# EAGLE design BMS (EAGLE 9.1.0)
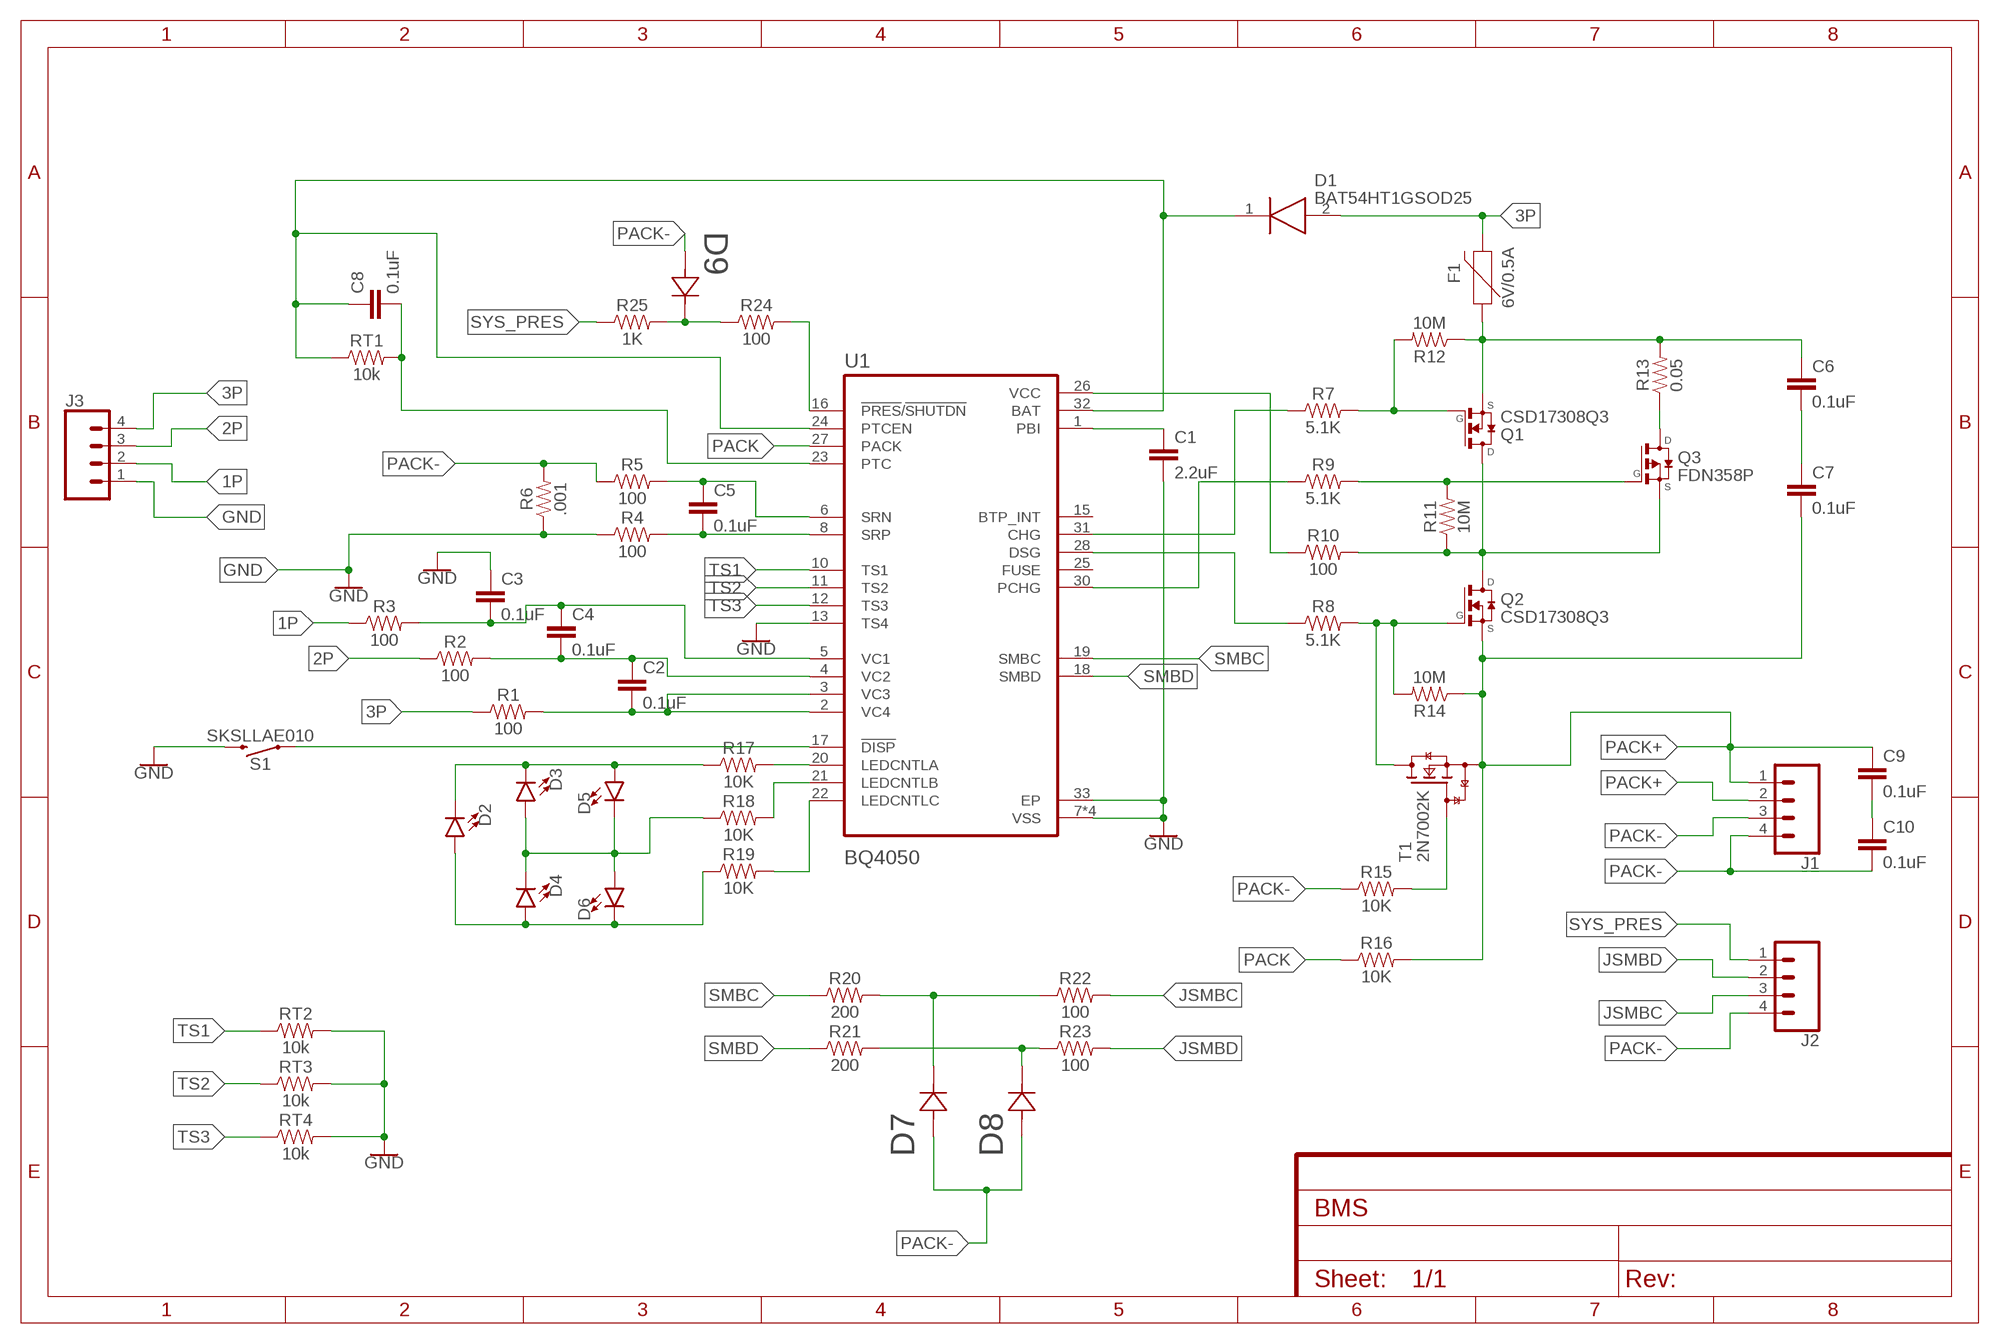
[diagram p0: schematic, sheet 1]

## Parts
C1  2.2uF  2.2UF-CERCAP-07888  [0402-CAP]
C2  0.1uF  0.1UF-0402-16V-10%  [0402]
C3  0.1uF  0.1UF-0402-16V-10%  [0402]
C4  0.1uF  0.1UF-0402-16V-10%  [0402]
C5  0.1uF  0.1UF-0402-16V-10%  [0402]
C6  0.1uF  0.1UF-0402-16V-10%  [0402]
C7  0.1uF  0.1UF-0402-16V-10%  [0402]
C8  0.1uF  0.1UF-0402-16V-10%  [0402]
C9  0.1uF  0.1UF-0402-16V-10%  [0402]
C10  0.1uF  0.1UF-0402-16V-10%  [0402]
D1  BAT54HT1GSOD25  [SOD2512X100]
D2  LTW-S272TLA-1175391  [LTW-S272TLA-1175391]
D3  LTW-S272TLA-1175391  [LTW-S272TLA-1175391]
D4  LTW-S272TLA-1175391  [LTW-S272TLA-1175391]
D5  LTW-S272TLA-1175391  [LTW-S272TLA-1175391]
D6  LTW-S272TLA-1175391  [LTW-S272TLA-1175391]
D7  D7  MM3Z5V6ST1G  [SODFL2513X100]
D8  D8  MM3Z5V6ST1G  [SODFL2513X100]
D9  D9  MM3Z5V6ST1G  [SODFL2513X100]
F1  6V/0.5A  PPTC_HALF-AMP  [1206]
J1  CONN_041.3HOLE  [1X04_1.3HOLE]
J2  CONN_041.3HOLE  [1X04_1.3HOLE]
J3  CONN_041X04_NO_SILK  [1X04_NO_SILK]
Q1  CSD17308Q3  [SON8-Q3]
Q2  CSD17308Q3  [SON8-Q3]
Q3  FDN358P  [SSOT-3]
R1  100  100KOHM-0402-1/16W-1%  [0402]
R2  100  100KOHM-0402-1/16W-1%  [0402]
R3  100  100KOHM-0402-1/16W-1%  [0402]
R4  100  100KOHM-0402-1/16W-1%  [0402]
R5  100  100KOHM-0402-1/16W-1%  [0402]
R6  .001  RNC18AQ00R001FE  [RESC3015X65]
R7  5.1K  100KOHM-0402-1/16W-1%  [0402]
R8  5.1K  100KOHM-0402-1/16W-1%  [0402]
R9  5.1K  100KOHM-0402-1/16W-1%  [0402]
R10  100  100KOHM-0402-1/16W-1%  [0402]
R11  10M  100KOHM-0402-1/16W-1%  [0402]
R12  10M  100KOHM-0402-1/16W-1%  [0402]
R13  0.05  0.05OHM-2512-3W-1%  [2512]
R14  10M  100KOHM-0402-1/16W-1%  [0402]
R15  10K  100KOHM-0402-1/16W-1%  [0402]
R16  10K  100KOHM-0402-1/16W-1%  [0402]
R17  10K  100KOHM-0402-1/16W-1%  [0402]
R18  10K  100KOHM-0402-1/16W-1%  [0402]
R19  10K  100KOHM-0402-1/16W-1%  [0402]
R20  200  100KOHM-0402-1/16W-1%  [0402]
R21  200  100KOHM-0402-1/16W-1%  [0402]
R22  100  100KOHM-0402-1/16W-1%  [0402]
R23  100  100KOHM-0402-1/16W-1%  [0402]
R24  100  100KOHM-0402-1/16W-1%  [0402]
R25  1K  100KOHM-0402-1/16W-1%  [0402]
RT1  10k  TFPT1206L1002FM1206  [1206]
RT2  10k  NTCLE100E3  [NTC-RESISTOR]
RT3  10k  NTCLE100E3  [NTC-RESISTOR]
RT4  10k  NTCLE100E3  [NTC-RESISTOR]
S1  SKSLLAE010  [SWITCH]
T1  2N7002K  [SOT23]
U1  BQ4050  BQ4050RSMTBQ4050  [QFN40P400X400X100-33T140]

## Nets
1P: J3.2 R3.1
2P: J3.3 R2.1
3P: D1.2(A) F1.2 J3.4 R1.1
GND: C1.2 C3.1 J3.1 R4.1 R6.1 RT2.2 RT3.2 RT4.2 S1.P$2 U1.7(VSS) U1.9(VSS) U1.13(TS4) U1.14(VSS) U1.29(VSS) U1.33(EP)
JSMBC: J2.3 R22.2
JSMBD: J2.2 R23.2
N$1: C1.1 U1.1(PBI)
N$2: C5.2 R4.2 U1.8(SRP)
N$3: S1.P$1 U1.17(!DISP)
N$4: C3.2 C4.1 R3.2 U1.5(VC1)
N$5: C2.2 R1.2 U1.2(VC4) U1.3(VC3)
N$6: C5.1 R5.2 U1.6(SRN)
N$7: C2.1 C4.2 R2.2 U1.4(VC2)
N$8: Q1.4(G) R7.2 R12.2
N$9: R7.1 U1.31(CHG)
N$10: R8.1 U1.28(DSG)
N$11: Q2.4(G) R8.2 R14.2 T1.3(D)
N$12: Q1.5(D) Q1.6(D) Q1.7(D) Q1.8(D) Q2.5(D) Q2.6(D) Q2.7(D) Q2.8(D) Q3.2(S) R10.2 R11.1
N$13: R10.1 U1.26(VCC)
N$14: R9.1 U1.30(PCHG)
N$15: Q3.1(G) R9.2 R11.2
N$16: Q3.3(D) R13.P$1
N$18: R15.2 T1.1(G)
N$19: C6.2 C7.1
N$20: R17.2 U1.20(LEDCNTLA)
N$21: D2.P$1(C) D3.P$1(C) D5.P$2(A) R17.1
N$22: D2.P$2(A) D4.P$2(A) D6.P$1(C) R19.1
N$23: R19.2 U1.22(LEDCNTLC)
N$24: R18.2 U1.21(LEDCNTLB)
N$25: D3.P$2(A) D4.P$1(C) D5.P$1(C) D6.P$2(A) R18.1
N$26: D7.1 R20.2 R22.1
N$27: D8.1 R21.2 R23.1
N$28: C9.2 C10.1
N$29: C6.1 F1.1 Q1.1(S) Q1.2(S) Q1.3(S) R12.1 R13.P$2
N$30: R24.2 U1.16(!PRES!/!SHUTDN)
N$31: D9.1 R24.1 R25.2
N$33: C8.2 RT1.2 U1.23(PTC)
N$34: C8.1 D1.1(K) RT1.1 U1.24(PTCEN) U1.32(BAT)
PACK: R16.1 U1.27(PACK)
PACK+: C7.2 C9.1 J1.1 J1.2 Q2.1(S) Q2.2(S) Q2.3(S) R14.1 R16.2 T1.2(S)
PACK-: C10.2 D7.2 D8.2 D9.2 J1.3 J1.4 J2.4 R5.1 R6.2 R15.1
SMBC: R20.1 U1.19(SMBC)
SMBD: R21.1 U1.18(SMBD)
SYS_PRES: J2.1 R25.1
TS1: RT2.1 U1.10(TS1)
TS2: RT3.1 U1.11(TS2)
TS3: RT4.1 U1.12(TS3)
Unconnected: U1.15(BTP_INT) U1.25(FUSE)

## Library data of the parts
C1 = SparkFun-Retired:2.2UF-CER: 2.2uF Ceramic SMT CAP-07888- 10V, 20% (0603) CAP-10009- 50V, 10% (1206); PROD_ID: CAP-07888
C2-C10 = SparkFun-Capacitors:0.1UF: 0.1µF ceramic capacitors A capacitor is a passive two-terminal electrical component used to store electrical energy temporarily in an electric field.; PROD_ID: CAP-12416
D1 = BAT54HT1G:BAT54HT1G: ON Semi BAT54HT1G, SMT Schottky Switching Diode, 30V 200mA, 5ns, 2-Pin SOD-323 Source: Datasheet <https://componentsearchengine.com/Datasheets/1/BAT54HT1G.pdf>
D2-D6 = LTW-S272TLA-1175391:LTW-S272TLA-1175391
D7-D9 = MM3Z5V6ST1G:MM3Z5V6ST1G
F1 = SparkFun-Fuses:PPTC: Resettable Fuse PPTC Resettable Fuse. Really a sort of resistor with a polymeric positive temperature coefficient whose resistance increases dramatically with an increase in temperature. When heated by the power passing through the resistance rises causing the current to be limited, protecting the circuit. This is achieved by the transition of the polymer from a crystalline to an amorphous state where the conductive carbon separates breaking the conductive pathways found in the cool crystalline structure. When a PPTC cools back down it resumes conducting letting the circuit turn back on. SparkFun Products: SparkFun RedBoard - Programmed with Arduino <https://www.sparkfun.com/products/12757> Pro Micro - 5V/16MHz <https://www.sparkfun.com/products/12640> Arduino Pro 328 - 5V/16MHz <https://www.sparkfun.com/products/10915> MP3 Trigger <https://www.sparkfun.com/products/13720>; PROD_ID: RES-08585
J1 J2 = SparkFun-Connectors:CONN_04: Multi connection point. Often used as Generic Header-pin footprint for 0.1 inch spaced/style header connections On any of the 0.1 inch spaced packages, you can populate with these: Break Away Headers - Straight <https://www.sparkfun.com/products/116> (PRT-00116) Break Away Male Headers - Right Angle <https://www.sparkfun.com/products/553> (PRT-00553) Female Headers <https://www.sparkfun.com/products/115> (PRT-00115) Break Away Headers - Machine Pin <https://www.sparkfun.com/products/117> (PRT-00117) Break Away Female Headers - Swiss Machine Pin <https://www.sparkfun.com/products/743> (PRT-00743) For SCREWTERMINALS and SPRING TERMINALS visit here: Screw Terimnals on SparkFun.com <https://www.sparkfun.com/search/results?term=Screw+Terminals> (5mm/3.5mm/2.54mm spacing) This device is also useful as a general connection point to wire up your design to another part of your project. Our various solder wires solder well into these plated through hole pads. Hook-Up Wire - Assortment (Stranded, 22 AWG) <https://www.sparkfun.com/products/11375> (PRT-11375) Hook-Up Wire - Assortment (Solid Core, 22 AWG) <https://www.sparkfun.com/products/11367> (PRT-11367) View the entire wire category on our website here <https://www.sparkfun.com/categories/141> Special notes: Molex polarized connector foot print use with SKU : PRT-08231 with associated crimp pins and housings. 1MM SMD Version SKU: PRT-10208
J3 = SparkFun-Connectors:CONN_04: Multi connection point. Often used as Generic Header-pin footprint for 0.1 inch spaced/style header connections On any of the 0.1 inch spaced packages, you can populate with these: Break Away Headers - Straight <https://www.sparkfun.com/products/116> (PRT-00116) Break Away Male Headers - Right Angle <https://www.sparkfun.com/products/553> (PRT-00553) Female Headers <https://www.sparkfun.com/products/115> (PRT-00115) Break Away Headers - Machine Pin <https://www.sparkfun.com/products/117> (PRT-00117) Break Away Female Headers - Swiss Machine Pin <https://www.sparkfun.com/products/743> (PRT-00743) For SCREWTERMINALS and SPRING TERMINALS visit here: Screw Terimnals on SparkFun.com <https://www.sparkfun.com/search/results?term=Screw+Terminals> (5mm/3.5mm/2.54mm spacing) This device is also useful as a general connection point to wire up your design to another part of your project. Our various solder wires solder well into these plated through hole pads. Hook-Up Wire - Assortment (Stranded, 22 AWG) <https://www.sparkfun.com/products/11375> (PRT-11375) Hook-Up Wire - Assortment (Solid Core, 22 AWG) <https://www.sparkfun.com/products/11367> (PRT-11367) View the entire wire category on our website here <https://www.sparkfun.com/categories/141> Special notes: Molex polarized connector foot print use with SKU : PRT-08231 with associated crimp pins and housings. 1MM SMD Version SKU: PRT-10208; PROD_ID: CONN-09696
Q1 Q2 = CSD17308Q3:CSD17308Q3: N-Channel MOSFET; DESCRIPTION: 30V N-Channel NexFET? Power MOSFET 8-VSON-CLIP -55 to 150; DIGI-KEY_PART_NUMBER: 296-27210-1-ND; DIGI-KEY_PURCHASE_URL: https://www.digikey.in/product-detail/en/texas-instruments/CSD17308Q3/296-27210-1-ND/2258731?utm_source=snapeda&utm_medium=aggregator&utm_campaign=symbol; MF: Texas Instruments; MP: CSD17308Q3; PACKAGE: VSON-8 Texas Instruments
Q3 = FDN358P:FDN358P: Single P-Channel MOSFET Logic Level, PowerTrench; DESCRIPTION: Single P-Channel Logic Level PowerTrench® MOSFET -30V, -1.5A, 125mΩ; DIGI-KEY_PART_NUMBER: FDN358PCT-ND; DIGI-KEY_PURCHASE_URL: https://www.digikey.in/product-detail/en/on-semiconductor/FDN358P/FDN358PCT-ND/965606?utm_source=snapeda&utm_medium=aggregator&utm_campaign=symbol; MF: ON Semiconductor; MP: FDN358P; PACKAGE: SC-59 ON Semiconductor
R1-R5 R7-R12 R14-R25 = SparkFun-Resistors:100KOHM: 100kΩ resistor A resistor is a passive two-terminal electrical component that implements electrical resistance as a circuit element. Resistors act to reduce current flow, and, at the same time, act to lower voltage levels within circuits. - Wikipedia; PROD_ID: RES-13495; VALUE: 100K
R6 = BMS:RNC18AQ00R001FE
R13 = SparkFun-Resistors:0.05OHM: 0.05Ω resistor A resistor is a passive two-terminal electrical component that implements electrical resistance as a circuit element. Resistors act to reduce current flow, and, at the same time, act to lower voltage levels within circuits. - Wikipedia; PROD_ID: RES-13771
RT1 = BMS:TFPT1206L1002FM
RT2-RT4 = BMS:NTCLE100E3
S1 = BMS:SKSLLAE010
T1 = 2N7002K:2N7002K: N-channel TrenchMOS FET N-channel enhancement mode Field-Effect Transistor (FET) in a plastic package using TrenchMOS technology. AAL Eindhoven MK; DESCRIPTION: N-Channel 60 V 2 Ohm SMT Enhancement Mode Field Effect Transistor SOT-23; DIGI-KEY_PART_NUMBER: 2N7002KCT-ND; DIGI-KEY_PURCHASE_URL: https://www.digikey.in/product-detail/en/on-semiconductor/2N7002K/2N7002KCT-ND/2060375?utm_source=snapeda&utm_medium=aggregator&utm_campaign=symbol; MF: ON Semiconductor; MP: 2N7002K; PACKAGE: SOT-23-3 ON Semiconductor
U1 = BQ4050RSMT:BQ4050RSMT: 1-4 Series CEDV Battery Fuel (Gas) Gauge 32-VQFN -40 to 85

## Board
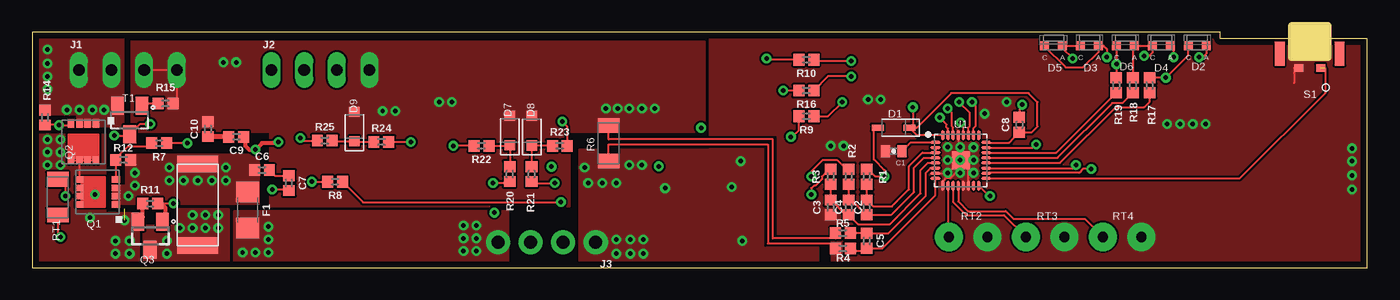
[diagram p1: board, top side]
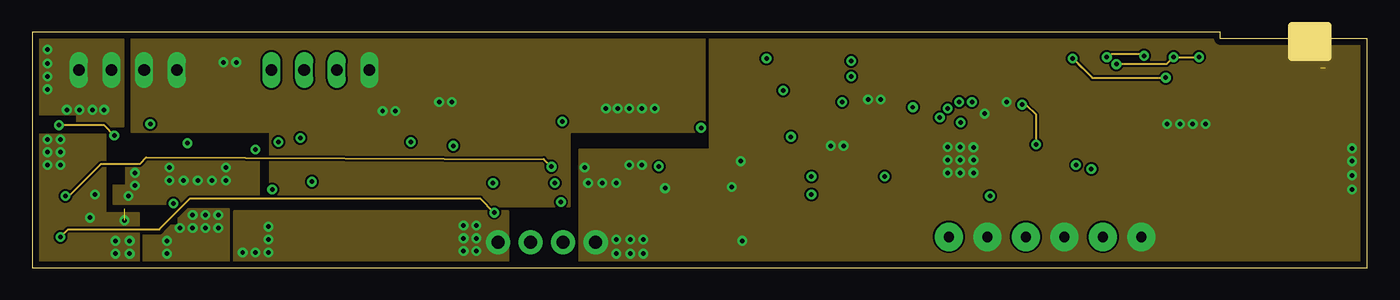
[diagram p2: board, inner layer Route2]
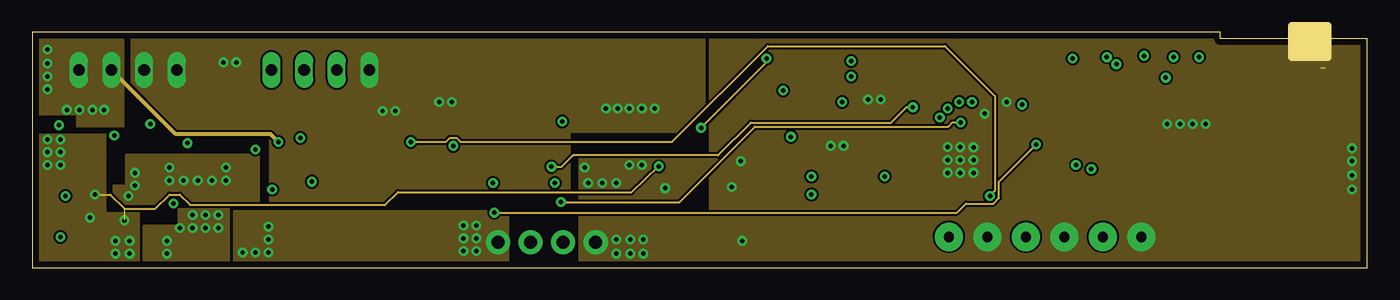
[diagram p3: board, inner layer Route15]
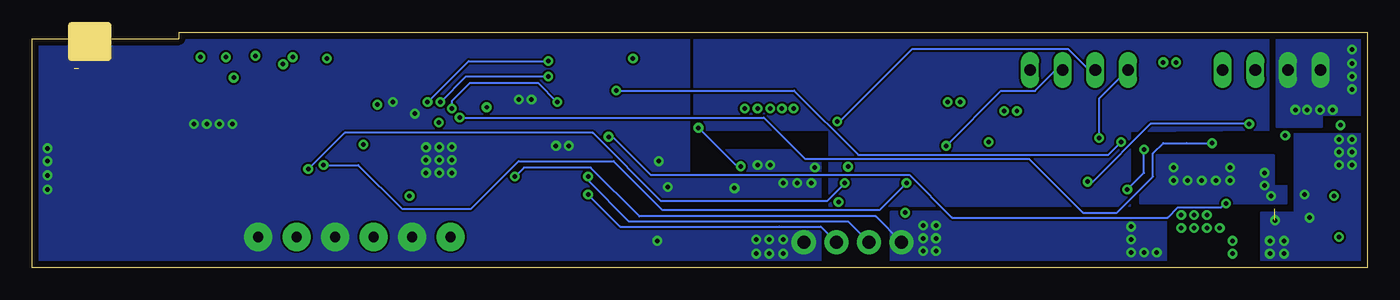
[diagram p4: board, bottom side, seen from below]

Size 104 x 18.35 mm. Coordinates in mm from the lower left corner, seen from the top.
Outline: 92.55,18.35 92.55,17.85 104,17.85 104,0 0,0 0,18.35
Outline: 92.55,18.35 0,18.35
Outline: 92.55,18.35 0,18.35
Copper layers (1+2*15+16): Top 0.07mm / dielectric 0.14mm / Route2 0.07mm / dielectric 0.33mm / Route15 0.07mm / dielectric 0.14mm / Bottom 0.07mm
Design rules "default *": minimum track width 6mil, minimum drill 0.3mm, track to track 6mil, track to pad 6mil, pad to pad 6mil, via to via 6mil, smd to smd 6mil, copper to edge 20mil, drill to drill 6mil, minimum pad ring 10mil, minimum via ring 8mil, stop-mask expansion 0.07mm, vias tented up to drill 0mil, thermal gap 10mil

### Footprints (pad centres in the part's own frame; a part is rotated, then mirrored left to right if it is on the bottom)
0402-CAP = smd 0.7 x 0.9: 1 -0.65,0; 2 0.65,0
0402 = smd 0.85 x 0.9: 1 -0.58,0; 2 0.58,0
SOD2512X100 = smd 0.942 x 0.497: 1 -1.237,0; 2 1.237,0
LTW-S272TLA-1175391 = smd 0.7 x 0.7: P$1 -0.7,0; P$2 0.7,0
SODFL2513X100 = smd 0.8 x 0.8: 1 -1.15,0; 2 1.15,0
1206 = smd 1.6 x 1.8: 1 -1.4,0; 2 1.4,0
1X04_1.3HOLE = drill 0.9 pad 1.27 long: 1 0,0; 2 2.54,0; 3 5.08,0; 4 7.62,0
1X04_NO_SILK = drill 1.016 pad 1.88: 1 0,0; 2 2.54,0; 3 5.08,0; 4 7.62,0
SON8-Q3 = smd 0.5 x 0.63: 1 -0.975,-1.435; 2 -0.325,-1.435; 3 0.325,-1.435; 4 0.975,-1.435; 5 0.975,1.435; 6 0.325,1.435; 7 -0.325,1.435; 8 -0.975,1.435
SSOT-3 = smd 1 x 1.4: 1 -0.95,-1.1; 2 0.95,-1.1; 3 0,1.1
RESC3015X65 = smd 1.131 x 1.67: 1 -1.395,0; 2 1.395,0
2512 = smd 1.27 x 3.175: P$1 -3.175,0; P$2 3.175,0
1206' = smd 1.131 x 1.67: 1 -1.395,0; 2 1.395,0
NTC-RESISTOR = drill 0.8 pad 2.184: 1 -1.5,0; 2 1.5,0
SWITCH = smd 0.7 x 0.6: P$1 -0.85,2.3; P$2 0.85,2.3 | smd 0.75 x 1.85: P$3 -2.325,1.175; P$4 2.325,1.175
SOT23 = smd 1 x 1.4: 1 -0.95,-1.1; 2 0.95,-1.1; 3 0,1.1
QFN40P400X400X100-33T140 = smd 0.788 x 0.22: 1 -1.971,1.4; 2 -1.971,1; 3 -1.971,0.6; 4 -1.971,0.2; 5 -1.971,-0.2; 6 -1.971,-0.6; 7 -1.971,-1; 8 -1.971,-1.4; 17 1.971,-1.4; 18 1.971,-1; 19 1.971,-0.6; 20 1.971,-0.2; 21 1.971,0.2; 22 1.971,0.6; 23 1.971,1; 24 1.971,1.4 | smd 0.22 x 0.788: 9 -1.4,-1.971; 10 -1,-1.971; 11 -0.6,-1.971; 12 -0.2,-1.971; 13 0.2,-1.971; 14 0.6,-1.971; 15 1,-1.971; 16 1.4,-1.971; 25 1.4,1.971; 26 1,1.971; 27 0.6,1.971; 28 0.2,1.971; 29 -0.2,1.971; 30 -0.6,1.971; 31 -1,1.971; 32 -1.4,1.971 | smd 1.4 x 1.4: 33 0,0

### Placement (x,y rotation side)
C1  67.11,9.07 180 top
C2  65,4.7 90 top
C3  62.2,4.7 90 top
C4  63.6,4.7 90 top
C5  65,2.1 270 top
C6  17.9,7.6 0 top
C7  20,6.6 270 top
C8  76.89,11.13 90 top
C9  15.9,10.2 180 top
C10  13.7,10.8 90 top
D1  67.1,10.9 180 top
D2  90.75,17.3 0 top
D3  82.35,17.3 0 top
D4  87.95,17.3 0 top
D5  79.55,17.3 0 top
D6  85.15,17.3 0 top
D7  37.21,10.69 90 top
D8  38.91,10.68 90 top
D9  25.1,11 90 top
F1  16.8,4.5 270 top
J1  3.65,15.41 0 top
J2  18.65,15.41 0 top
J3  43.9,2 180 top
Q1  5.1,5.9 90 top
Q2  4,9.8 180 top
Q3  9.2,2.5 180 top
R1  65,7.1 270 top
R2  63.6,7.1 270 top
R3  62.2,7.1 270 top
R4  63.15,1.5 0 top
R5  63.15,2.7 0 top
R6  44.9,9.7 90 top
R7  9.9,9.7 180 top
R8  23.6,6.7 180 top
R9  60.3,11.8 180 top
R10  60.3,16.2 180 top
R11  9.2,5 0 top
R12  7.1,8.4 180 top
R13  12.9,4.9 90 top
R14  1,11.7 270 top
R15  10.4,12.8 180 top
R16  60.3,13.8 180 top
R17  87.04,14.21 270 top
R18  85.73,14.21 270 top
R19  84.44,14.21 270 top
R20  37.2,7.3 90 top
R21  38.9,7.3 90 top
R22  35,9.5 180 top
R23  41.1,9.5 0 top
R24  27.2,9.8 0 top
R25  22.8,9.9 0 top
RT1  10k  [1206']  2,5.5 270 top
RT2  72.9,2.4 0 top
RT3  78.9,2.4 0 top
RT4  84.9,2.4 0 top
S1  99.5,17.85 180 top
T1  7.6,11.5 180 top
U1  72.33,8.36 0 top

### Tracks (layer width: path | path; a pad name or v marks a point on that pad's centre or on a via)
1P  (via drill 0.35)
  Top 0.152: R3.1 62.18,7.68 62,7.5 61.9,7.5 61.5,7.1 61.5,6.9 61,6.4 60.9,6.4 60.7,6.2 v60.7,5.7
  Bottom 0.152: v60.7,5.7 58.2,3.2 45.8,3.2 42.56,3.2 J3.2
2P  (via drill 0.35)
  Top 0.152: v60.7,7.1 60.7,7.3 60.7,7.5 61.6,8.4 62.68,8.4 63.3,7.78 63.4,7.68 R2.1
  Bottom 0.152: J3.3 40.42,3.6 57.5,3.6 60.7,6.8 v60.7,7.1
3P  (via drill 0.35)
  Top 0.152: D1.2 65.55,10.9 65.55,8.45 66.4,7.6 v66.4,7.1 65.68,7.1 65.1,7.68 R1.1
  Bottom 0.152: J3.4 38.28,4 56.7,4 60.5,7.8 65.7,7.8 v66.4,7.1
  other vias: 33.6,1.3 34.6,1.3 33.6,2.3 34.6,2.3 16.4,1.2 17.4,1.2 18.4,1.2 33.6,3.3 34.6,3.3 18.4,3.2 18.4,2.2
  pour Top (no thermals): 15.7,4.4 15.7,0.5 37.1,0.5 37.1,4.4
  pour Bottom (no thermals): 15.7,4.4 15.7,0.3 37.1,0.3 37.1,4.4
  pour Route15 (no thermals): 15.7,4.4 15.7,0 37.1,0 37.1,4.4
  pour Route2 (no thermals): 15.7,4.4 15.7,-0.2 37.1,-0.2 37.1,4.4
GND  (via drill 0.35)
  Top 0.152: U1.7 71.33,7.36 U1.33 | U1.14 72.93,7.76 U1.33 | U1.29 72.13,8.56 U1.33 | U1.33 72.33,7.79 71.55,7.01 71.2,7.01 71.19,7.01 70.93,6.75 U1.9 | R6.1 44.9,9.6 57.3,9.6 57.3,1.9 62.57,1.9 R4.1 | 98.3,14.4 98.3,15.15 98.3,15.55
  other vias: 71.3,9.4 72.29,9.39 73.32,9.38 71.3,8.4 72.29,8.4 73.32,8.4 71.3,7.4 72.29,7.4 73.32,7.4 55.2,8.3 54.5,6.3 55.3,2.1 88.4,11.2 89.4,11.2 90.4,11.2 91.4,11.2 75.9,12.9 74.2,12 49.3,6.2 46.5,8 47.5,8 46.6,2.2 47.6,2.2 47.6,1.1 62.2,9.5 63.2,9.5 65.1,13.1 66.1,13.1 102.8,9.3 102.8,8.3 102.8,7.2 102.8,6.1 45.5,2.2 45.5,1.1 46.6,1.1 43.3,6.6 44.4,6.6 45.5,6.6 43.03,7.82
  pour Route2 (no thermals): 52.8,19.4 111.7,19.4 111.7,-2.3 52.8,-2.3
  pour Top (no thermals): 52.8,19.51 111.5,19.6 111.5,-2.3 52.8,-2.3
  pour Top (no thermals): 47.1,9.2 42.6,9.2 42.6,-2.6 53.8,-2.6 53.8,9.2
  cutout Top: 44.1,10.5 45.7,10.5 45.7,8.9 44.1,8.9
  cutout Top: 45.5,10.2 57.9,10.2 57.9,2.5 62.1,2.5 62.1,1.7 57.1,1.7 57.1,9.4 45.5,9.4
  cutout Top: 61.4,1.6 62.1,1.6 62.1,0 61.4,0
  pour Route2 (no thermals): 47.1,9.2 42.6,9.2 42.6,-2.2 53.8,-2.2 53.8,9.2
  pour Bottom (no thermals): 47.1,9.2 42.6,9.2 42.6,-1.9 53.8,-1.9 53.8,9.2
  pour Route15 (no thermals): 47.1,9.2 42.6,9.2 42.6,-3.1 53.8,-3.1 53.8,9.2
  pour Bottom (no thermals): 52.8,19.91 111.5,20 111.5,-2 52.8,-2
  pour Route15 (no thermals): 52.8,19.71 111.5,19.8 111.5,-2.1 52.8,-2.1
JSMBC  (via drill 0.35)
  Top 0.152: R22.2 v32.8,9.5
  Bottom 0.152: v32.8,9.5 28.53,13.77 25.88,13.77 24.25,15.41 J2.3
JSMBD  (via drill 0.35)
  Top 0.152: v41.3,11.4 41.68,11.02 R23.2
  Bottom 0.152: J2.2 21.71,15.41 23.34,17.05 35.45,17.05 41.1,11.4 v41.3,11.4
N$1
  Top 0.152: C1.1 68.44,9.76 U1.1
N$2
  Top 0.152: U1.8 70.35,5.65 66.22,1.52 C5.2 64.78,1.3 63.93,1.3 R4.2
N$3  (1 unrouted)
  Top 0.152: U1.17 94.06,6.96 100.7,13.6 100.7,15.55
N$4
  Top 0.152: R3.2 C3.2 62.71,4.77 62.74,4.77 62.88,4.64 62.88,4.6 63.36,4.12 C4.1 64.32,3.4 66.8,3.4 69.2,5.8 69.2,7.6 69.76,8.16 U1.5
N$5
  Top 0.152: R1.2 C2.2 65.5,4.78 66.98,4.78 68.3,6.1 68.3,7.9 69.36,8.96 U1.3 U1.2
N$6
  Top 0.152: U1.6 69.96,7.76 69.6,7.4 69.6,5.6 66.68,2.68 C5.1 64.98,2.7 R5.2 63.75,2.68
N$7
  Top 0.152: R2.2 C4.2 63.84,5.28 64.32,4.8 64.32,4.76 64.45,4.63 64.49,4.63 C2.1 66.92,4.12 68.7,5.9 68.7,7.8 69.46,8.56 U1.4
N$8
  Top 0.152: Q1.4 6.54,8.4 R12.2 6.52,8.52 7.47,9.47 9.09,9.47 R7.2
N$9  (via drill 0.35)
  Top 0.152: v70.7,11.7 71.23,11.17 71.23,10.93 71.33,10.83 U1.31 | v12.1,9.7 R7.1
  Bottom 0.152: v70.7,11.7 47,11.7 43.79,8.49 26.35,8.49 22.15,4.29 19.51,4.29 16.9,6.9 16.7,7.1 16.7,8.9 15.9,9.7 14.1,9.7 v12.1,9.7
N$10  (via drill 0.35)
  Top 0.152: R8.1 25.78,5.1 41.17,5.1 v41.19,5.12 | U1.28 72.53,11.12 v72.33,11.32
  Route15 0.152: v41.19,5.12 50.42,5.12 56.3,11 71.36,11 71.68,11.32 v72.33,11.32
N$11  (via drill 0.35)
  Top 0.152: 3.02,11.12 Q2.4 2.89,11.1 v2.1,11.1 2.08,11.12 R14.2 | v6.4,10.3 7.5,10.3 T1.3 8.4,11.2 v9.2,11.2 | v21.8,6.7 R8.2
  Route2 0.152: v6.4,10.3 5.6,11.1 v2.1,11.1
  Bottom 0.152: v9.2,11.2 16.9,11.2 21.4,6.7 v21.8,6.7
N$12  (via drill 0.35)  (1 unrouted)
  Top 0.152: Q2.5 Q2.6 3.7,8.37 | 3.7,8.37 Q2.7 Q2.8 | R10.2 57.3,16.2 v57.2,16.3 | Q1.5 3.7,6.91 3.7,8.37
  Top 0.305: Q3.2 8.62,3.97 R11.1
  Route15 0.152: v4.9,5.7 6.1,5.7 7.2,4.6 9.6,4.6 10.7,5.7 11.5,5.7 12.3,4.9 15.7,4.9 18.2,4.9 27.5,4.9 28.5,5.9 40.9,5.9 46.7,5.9 v48.8,7.9 | v52.1,10.9 57.2,16 v57.2,16.3
  Bottom 0.152: v52.1,10.9 49.1,7.9 v48.8,7.9
  other vias: 7.6,2.1 6.5,2.1 4.5,3.9 7.2,3.7 6.5,1.1 7.6,1.1 1.2,10 2.2,10 1.2,9 2.2,9 1.2,8 2.2,8
  pour Top (no thermals): -0.7,10.4 5.7,10.4 5.7,-0.1 -0.7,-0.1
  pour Top (no thermals): 5.7,4.3 8.3,4.3 8.3,-0.1 5.7,-0.1
  pour Route15 (no thermals): -0.7,10.4 5.7,10.4 5.7,-0.4 -0.7,-0.4
  pour Bottom (no thermals): -0.7,10.4 5.7,10.4 5.7,-1.4 -0.7,-1.4
  pour Route15 (no thermals): 5.7,4.3 8.3,4.3 8.3,-0.3 5.7,-0.3
  pour Bottom (no thermals): 5.7,4.3 8.3,4.3 8.3,-0.8 5.7,-0.8
  pour Route2 (no thermals): 5.7,4.3 8.3,4.3 8.3,-0.8 5.7,-0.8
  pour Route2 (no thermals): -0.7,10.4 5.7,10.4 5.7,-1.4 -0.7,-1.4
N$13  (via drill 0.35)
  Top 0.152: U1.26 73.33,10.87 73.51,11.05 73.51,12.59 v73.2,12.9 | v63.8,16.1 60.98,16.1 R10.1
  Bottom 0.152: v73.2,12.9 70,16.1 v63.8,16.1
N$14  (via drill 0.35)
  Top 0.152: v71.3,12.4 71.63,12.07 71.63,11.03 71.73,10.93 U1.30 | R9.1 62,11.8 v63.1,12.9
  Bottom 0.152: v63.1,12.9 64.6,14.4 69.9,14.4 71.3,13 v71.3,12.4
N$15  (via drill 0.35)
  Top 0.152: R9.2 59.72,10.72 59.2,10.2 v59.1,10.2 | v11,5 R11.2
  Top 0.305: Q3.1 10.35,3.8 10.35,4.73 10.08,5 R11.2
  Bottom 0.152: v11,5 11.1,5 11.4,4.7 12.24,4.7 12.25,4.71 14.75,4.71 15.56,3.9 32.34,3.9 35.65,7.21 55.81,7.21 58.8,10.2 v59.1,10.2
N$16  (via drill 0.35)
  other vias: 10.5,2.1 12.5,4.1 11.5,3.1 12.5,3.1 13.5,3.1 14.5,3.1 13.5,4.1 14.5,4.1 10.5,1.1
  pour Top (no thermals): 8.7,3.3 11.4,3.3 11.4,4.6 15.3,4.6 15.3,3.3 15.3,-1.5 8.7,-1.5
  pour Route15 (no thermals): 8.7,3.3 11.4,3.3 11.4,4.6 15.3,4.6 15.3,3.3 15.3,-1.8 8.7,-1.8
  pour Route2 (isolate 0.305, no thermals): 8.7,3.3 11.4,3.3 11.4,4.6 15.3,4.6 15.3,3.3 15.3,-1.8 8.7,-1.8
N$18
  Top 0.152: T1.1 8.75,12.8 R15.2
N$19
  Top 0.152: C6.2 18.9,7.18 C7.1
N$20
  Top 0.152: U1.20 80.06,8.16 84.4,12.5 86.61,12.5 87.04,12.93 R17.2
N$21  (via drill 0.35)
  Top 0.152: v81.05,16.3 80.25,17.1 D5.P$2 D3.P$1 | R17.1 v88.29,14.79 v88.3,14.8 90.05,16.55 D2.P$1
  Route2 0.152: 81.8,15.55 v81.05,16.3 82.56,14.79 v88.29,14.79 v88.3,14.8
N$22  (via drill 0.35)
  Top 0.152: R19.1 | D4.P$2 88.9,17.05 v88.9,16.4 | v90.9,16.4 91.2,16.4 91.45,16.65 D2.P$2 | R19.1 v84.45,15.85 D6.P$1 | R19.1 | D6.P$1
  Route2 0.152: v90.9,16.4 v88.9,16.4 88.35,15.85 v84.45,15.85
N$23
  Top 0.152: U1.22 79.76,8.96 R19.2
N$24
  Top 0.152: U1.21 79.86,8.56 84.13,12.83 84.93,12.83 R18.2
N$25  (via drill 0.35)
  Top 0.152: 85.73,17.18 85.81,17.26 85.85,17.26 | v83.7,16.4 83.7,17.05 83.45,17.3 D3.P$2 83.05,16.8 81.85,15.6 80.5,15.6 78.85,17.25 | 78.85,17.25 78.85,17.26 | v86.6,16.51 87.01,16.51 87.25,16.75 D4.P$1 D6.P$2 85.73,17.18 | D5.P$1 78.85,17.25 | 85.73,17.18 R18.1
  Route2 0.152: v83.7,16.4 83.84,16.4 84.05,16.61 86.5,16.61 v86.6,16.51
N$26
  Top 0.152: R22.1 37.17,9.5 D7.1 R20.2
N$27
  Top 0.152: R21.2 D8.1 40.49,9.53 R23.1
N$28
  Top 0.152: 13.72,10.2 C10.1
  Top 0.406: C9.2 13.72,10.2
N$29  (via drill 0.35)
  Top 0.152: R13.P$2 12.94,8.04 12.94,8.4
  other vias: 8,7.4 7.5,5.6 11.8,6.8 12.9,6.8 14,6.8 15.1,6.8 8,6.4 10.7,7.8 10.7,6.8 15.1,7.8
  pour Top (no thermals): 6.3,5 17.7,5 17.7,6.4 17.7,8.7 17.7,8.8 7.3,8.8 7.3,6.4 6.3,6.4
  pour Bottom (no thermals): 6.3,5 17.7,5 17.7,6.4 17.7,8.8 7.3,8.8 7.3,6.4 6.3,6.4
  pour Route2 (no thermals): 6.3,5 17.7,5 17.7,6.4 17.7,8.8 7.3,8.8 7.3,6.4 6.3,6.4
  pour Route15 (no thermals): 6.3,5 17.7,5 17.7,6.4 17.7,8.8 7.3,8.8 7.3,6.4 6.3,6.4
N$30  (via drill 0.35)
  Top 0.152: R24.2 v29.5,9.8 | U1.16 74.52,5.6 v74.6,5.6
  Route15 0.152: v29.5,9.8 32.24,9.8 32.55,10.11 33.05,10.11 33.36,9.8 49.84,9.8 57.3,17.26 71.1,17.26 75,13.36 75,6 v74.6,5.6
N$31
  Top 0.152: R25.2 23.43,9.85 D9.1 25.15,9.8 R24.1
N$33  (via drill 0.35)
  Top 0.152: U1.23 77.96,9.36 v78.2,9.6 | RT1.2 2,2.6 v2.2,2.4 | v77.1,12.7 76.89,12.49 C8.2
  Route2 0.152: v78.2,9.6 78.2,11.9 77.4,12.7 v77.1,12.7 | v36,4.29 34.89,5.4 12.3,5.4 9.9,3 2.8,3 v2.2,2.4
  Route15 0.152: v36,4.29 72.05,4.29 72.75,4.99 74.85,4.99 75.31,5.45 75.31,6.71 v78.2,9.6
N$34  (via drill 0.35)
  Top 0.152: U1.24 74.31,9.75 76.1,9.75 76.42,10.07 76.42,10.09 C8.1 77.85,10.55 78.3,11 78.3,12.9 77.6,13.6 71.6,13.6 68.9,10.9 D1.1 | U1.32 69.03,10.33 69,10.3 68.94,10.3 D1.1 | v2.6,5.6 2.6,6.29 RT1.1 | v68.6,12.5 68.6,11.16 D1.1
  Route2 0.152: v40.45,7.87 39.85,8.47 8.9,8.6 8.4,8.1 5.4,8.1 2.9,5.6 v2.6,5.6
  Route15 0.152: 67.57,11.97 68.1,12.5 | 68.1,12.5 67.55,11.95 66.91,11.3 55.97,11.3 53.43,8.76 42.14,8.76 41.25,7.87 v40.45,7.87 | 68.1,12.5 v68.6,12.5
PACK  (via drill 0.35)
  Top 0.152: v72.2,12.9 73.03,12.07 73.03,11.03 72.93,10.93 U1.27 | v63.8,14.9 61.98,14.9 R16.1
  Bottom 0.152: v63.8,14.9 70.2,14.9 v72.2,12.9
PACK+  (via drill 0.35)
  Top 0.152: R16.2 v58.5,13.8 | C7.2 19.98,6 C7.2 | v19.19,9.79 19.1,9.7 | v18.7,6.1 19.92,6.1 C7.2 | C9.1 16.6,10.08
  Top 0.305: 19.1,9.7 17.9,9.7 v17.4,9.2 16.9,9.2 16.6,9.5 16.6,10.08
  Route15 0.305: v19.19,9.79 18.57,10.41 11.19,10.41 6.29,15.31 J1.2
  Bottom 0.152: v58.5,13.8 44.66,13.8 39.65,8.79 20.18,8.79 v19.19,9.79 | v18.7,6.1 17.4,7.4 v17.4,9.2
  other vias: 4.7,12.3 3.7,12.3 5.61,12.3 2.7,12.3 1.2,17 1.2,15.9 1.2,14.9 1.2,13.9
  pour Top (no thermals): -1.5,19.1 7.1,19.1 7.1,11.9 7.1,11 3.5,11 3.5,11.9 -1.5,11.9
  pour Route2 (no thermals): -1.5,20.3 7.1,20.3 7.1,11.9 7.1,11 3.5,11 3.5,11.9 -1.5,11.9
  pour Route15 (no thermals): -1.5,20 7.1,20 7.1,11.9 7.1,11 3.5,11 3.5,11.9 -1.5,11.9
  pour Bottom (no thermals): -1.5,19.6 7.1,19.6 7.1,11.9 7.1,11.1 7.1,11 3.5,11 3.5,11.9 -1.5,11.9
PACK-  (via drill 0.35)
  Top 0.152: J1.3 J1.4 11.27,13.09 R15.1 | D7.2 | R5.1 62.57,2.3 57.7,2.3 57.7,10 44.9,10 R6.2
  other vias: 31.7,12.9 32.7,12.9 46.5,12.4 47.5,12.4 48.5,12.4 44.7,12.4 45.6,12.4 28.3,12.2 27.3,12.2 15.9,16 14.9,16
  pour Top (no thermals): 7.7,17.6 7.7,10.6 18.5,10.6 18.5,4.8 41.9,4.8 41.9,10.6 52.4,10.6 52.4,17.6
  pour Route2 (no thermals): 7.7,17.9 7.7,10.6 18.5,10.6 18.5,4.8 41.9,4.8 41.9,10.5 41.9,10.6 52.4,10.6 52.4,17.9
  pour Route15 (no thermals): 7.7,18.2 7.7,10.6 18.5,10.6 18.5,4.8 41.9,4.8 41.9,10.6 52.4,10.6 52.4,18.2
PACK-1
  pour Bottom (no thermals): 7.7,18.7 7.7,10.7 18.5,10.6 18.5,4.8 41.9,4.8 41.9,10.7 52.4,10.7 52.4,18.7
SMBC  (via drill 0.35)
  Top 0.152: R20.1 37.08,6.6 v35.9,6.6 | U1.19 81.06,7.76 v81.3,8
  Bottom 0.152: v35.9,6.6 38,4.5 54.9,4.5 58.7,8.3 66.1,8.3 69.8,4.6 75.2,4.6 78.6,8 v81.3,8
SMBD  (via drill 0.35)
  Top 0.152: R21.1 39.02,6.6 v40.7,6.6 | v82.5,7.7 81.86,7.7 81.55,7.39 74.33,7.39 U1.18
  Bottom 0.152: v82.5,7.7 82.46,7.7 79.65,10.51 60.31,10.51 55,5.2 42.1,5.2 v40.7,6.6
SYS_PRES  (via drill 0.35)
  Top 0.152: v20.9,10.1 21.1,9.9 R25.1
  Bottom 0.152: J2.1 20.9,13.16 v20.9,10.1
TS1
  Top 0.152: U1.10 71.33,2.47 RT2.1
TS2
  Top 0.152: RT3.1 75.7,4.1 72.76,4.1 71.73,5.13 U1.11
TS3
  Top 0.152: U1.12 72.13,5.17 72.89,4.41 75.83,4.41 76.43,3.8 82,3.8 RT4.1

### Text on the board
tPlace: S1
tDocu: R13
_bsilk: D5 | D3 | D6 | D4 | D2 | PACK+ | PACK+ | PACK- | PACK- | SMBD | SMBC | PACK- | SYS_PRES | TS1 | TS2 | TS3 | 3P | 2P | 1P | 1N